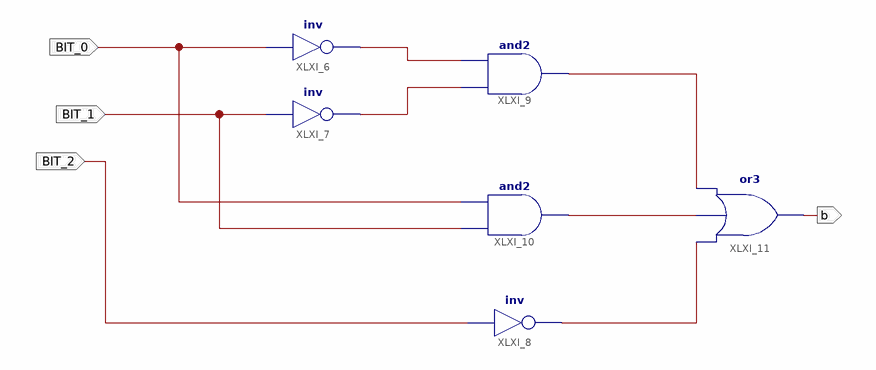
[diagram p0: schematic sheet 1]
// Xilinx ISE schematic SEG_B.sch (spartan6) as structural Verilog: 6 symbols, 4 ports
module SEG_B (
  input  BIT_0,
  input  BIT_1,
  input  BIT_2,
  output b
);

  wire XLXN_20, XLXN_21, XLXN_22, XLXN_23, XLXN_24;

  not XLXI_6 (XLXN_20, BIT_0);
  not XLXI_7 (XLXN_21, BIT_1);
  not XLXI_8 (XLXN_24, BIT_2);
  and XLXI_9 (XLXN_22, XLXN_21, XLXN_20);
  and XLXI_10 (XLXN_23, BIT_1, BIT_0);
  or XLXI_11 (b, XLXN_24, XLXN_23, XLXN_22);
endmodule
